# EasyEDA Pro project custom_ctrl_20250401.epro, schematic Schematic1
Board Name: typec; Create Date: 2025-01-17; Page Name: P1; Project Name: custom control; Schematic Name: Schematic1; Update Date: 2025-03-17; Company: 嘉立创EDA; Page Size: A4; Version: V1.0
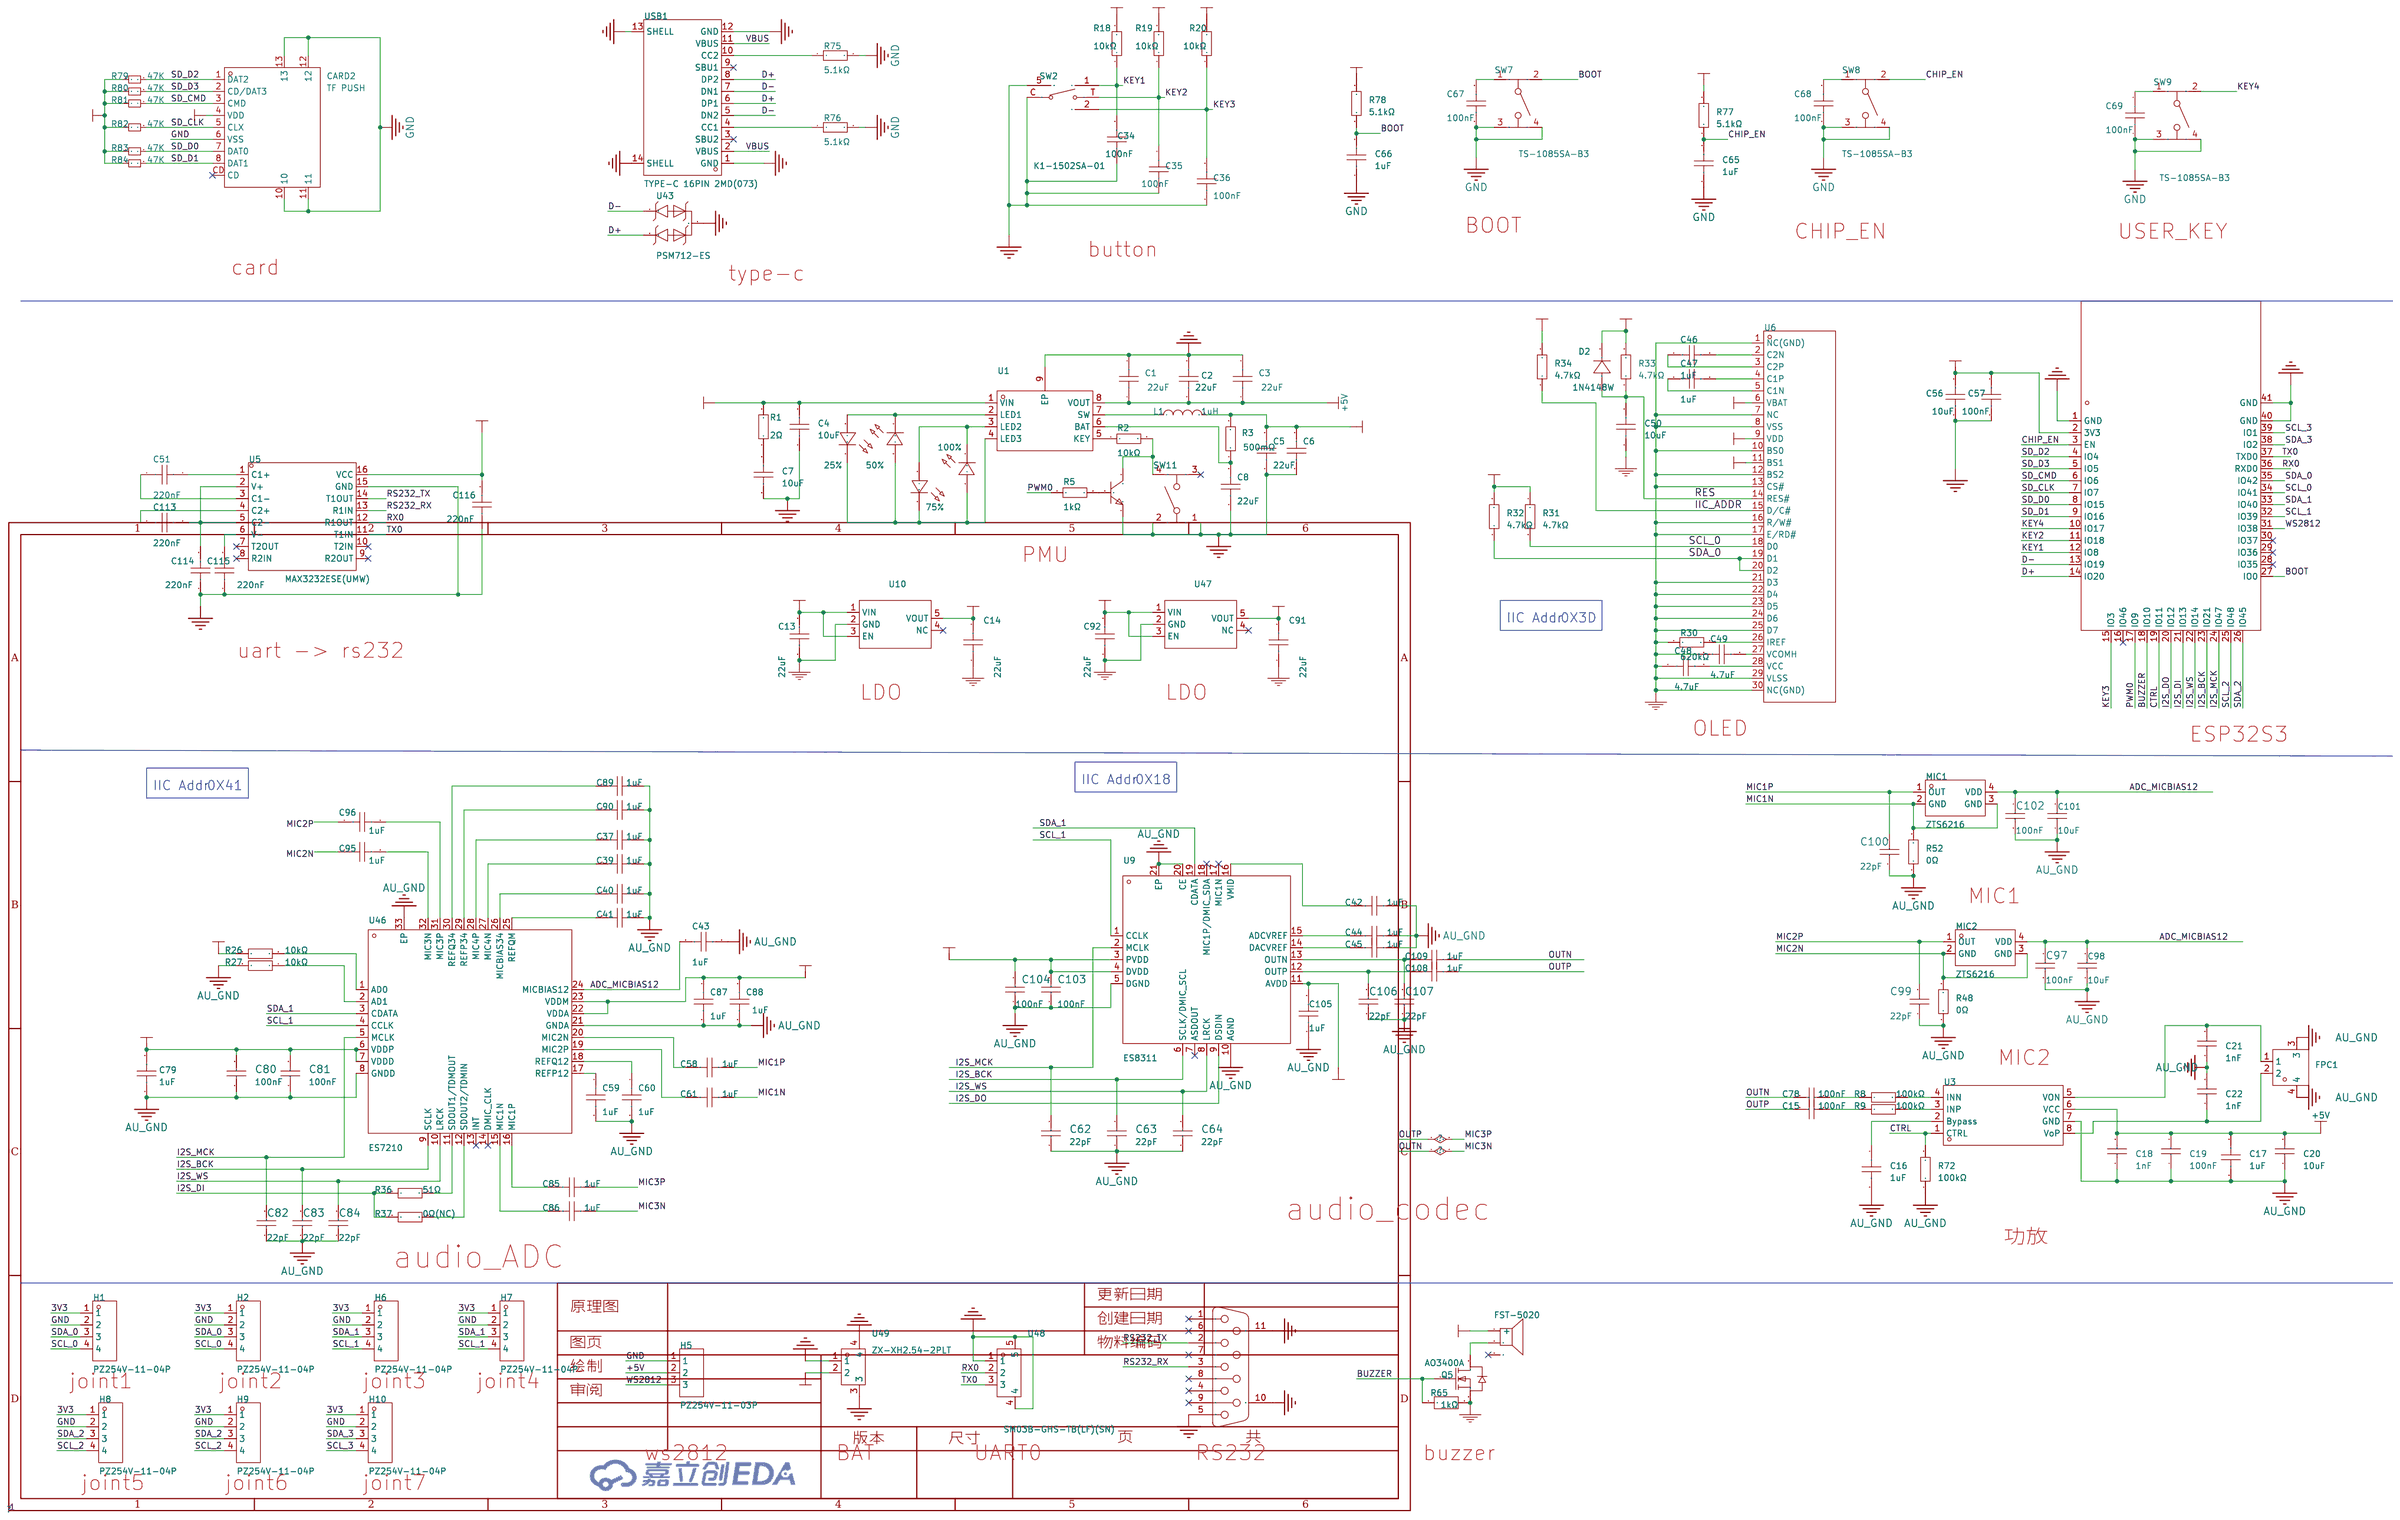
[diagram p0: schematic sheet]

## Parts
BUZZER1  FST-5020  [BUZ-SMD_FST-5020]
C1  22uF  [C0603]
C2  22uF  [C0603]
C3  22uF  [C0603]
C4  10uF  [C0402]
C5  22uF  [C0603]
C6  22uF  [C0603]
C7  10uF  [C0402]
C8  22uF  [C0603]
C13  22uF  [C0603]
C14  22uF  [C0603]
C15  100nF  [C0402]
C16  1uF  [C0402]
C17  1uF  [C0402]
C18  1nF  [C0402]
C19  100nF  [C0402]
C20  10uF  [C0402]
C21  1nF  [C0402]
C22  1nF  [C0402]
C34  100nF  [C0402]
C35  100nF  [C0402]
C36  100nF  [C0402]
C37  1uF  [C0402]
C39  1uF  [C0402]
C40  1uF  [C0402]
C41  1uF  [C0402]
C42  1uF  [C0402]
C43  1uF  [C0402]
C44  1uF  [C0402]
C45  1uF  [C0402]
C46  1uF  [C0402]
C47  1uF  [C0402]
C48  4.7uF  [C0402]
C49  4.7uF  [C0402]
C50  10uF  [C0402]
C51  220nF  [C0402]
C56  10uF  [C0402]
C57  100nF  [C0402]
C58  1uF  [C0402]
C59  1uF  [C0402]
C60  1uF  [C0402]
C61  1uF  [C0402]
C62  22pF  [C0402]
C63  22pF  [C0402]
C64  22pF  [C0402]
C65  1uF  [C0402]
C66  1uF  [C0402]
C67  100nF  [C0402]
C68  100nF  [C0402]
C69  100nF  [C0402]
C78  100nF  [C0402]
C79  1uF  [C0402]
C80  100nF  [C0402]
C81  100nF  [C0402]
C82  22pF  [C0402]
C83  22pF  [C0402]
C84  22pF  [C0402]
C85  1uF  [C0402]
C86  1uF  [C0402]
C87  1uF  [C0402]
C88  1uF  [C0402]
C89  1uF  [C0402]
C90  1uF  [C0402]
C91  22uF  [C0603]
C92  22uF  [C0603]
C95  1uF  [C0402]
C96  1uF  [C0402]
C97  100nF  [C0402]
C98  10uF  [C0402]
C99  22pF  [C0402]
C100  22pF  [C0402]
C101  10uF  [C0402]
C102  100nF  [C0402]
C103  100nF  [C0402]
C104  100nF  [C0402]
C105  1uF  [C0402]
C106  22pF  [C0402]
C107  22pF  [C0402]
C108  1uF  [C0402]
C109  1uF  [C0402]
C113  220nF  [C0402]
C114  220nF  [C0402]
C115  220nF  [C0402]
C116  220nF  [C0402]
CARD2  TF PUSH  [TF-SMD_TF-PUSH]
D2  1N4148W  [SOD-123_L2.7-W1.6-LS3.7-RD-1]
D25  25%  [LED_0603]
D50  50%  [LED_0603]
D75  75%  [LED_0603]
D100  100%  [LED_0603]
FPC1  HC-1.25-2PLT  [CONN-SMD_HC-1.25-2PLT]
H1  PZ254V-11-04P  [HDR-TH_4P-P2.54-V-M]
H2  PZ254V-11-04P  [HDR-TH_4P-P2.54-V-M]
H5  PZ254V-11-03P  [HDR-TH_3P-P2.54-V-M]
H6  PZ254V-11-04P  [HDR-TH_4P-P2.54-V-M]
H7  PZ254V-11-04P  [HDR-TH_4P-P2.54-V-M]
H8  PZ254V-11-04P  [HDR-TH_4P-P2.54-V-M]
H9  PZ254V-11-04P  [HDR-TH_4P-P2.54-V-M]
H10  PZ254V-11-04P  [HDR-TH_4P-P2.54-V-M]
L1  1uH  [IND-SMD_L4.4-W4.2]
MIC1  ZTS6216  [MIC-SMD_4P-L2.8-W1.9-P1.84-TL]
MIC2  ZTS6216  [MIC-SMD_4P-L2.8-W1.9-P1.84-TL]
Q1  S8050  [SOT-23-3_L2.9-W1.6-P1.90-LS2.8-BR]
Q5  AO3400A  [SOT-23-3_L2.9-W1.6-P1.90-LS2.8-BR]
R1  2Ω  [R0402]
R2  10kΩ  [R0402]
R3  500mΩ  [R0603]
R5  1kΩ  [R0402]
R8  100kΩ  [R0402]
R9  100kΩ  [R0402]
R18  10kΩ  [R0402]
R19  10kΩ  [R0402]
R20  10kΩ  [R0402]
R26  10kΩ  [R0402]
R27  10kΩ  [R0402]
R30  620kΩ  [R0402]
R31  4.7kΩ  [R0402]
R32  4.7kΩ  [R0402]
R33  4.7kΩ  [R0402]
R34  4.7kΩ  [R0402]
R36  51Ω  [R0402]
R37  0Ω(NC)  [R0402]
R48  0Ω  [R0402]
R52  0Ω  [R0402]
R65  1kΩ  [R0402]
R72  100kΩ  [R0402]
R75  5.1kΩ  [R0402]
R76  5.1kΩ  [R0402]
R77  5.1kΩ  [R0402]
R78  5.1kΩ  [R0402]
R79  47K  [R0402]
R80  47K  [R0402]
R81  47K  [R0402]
R82  47K  [R0402]
R83  47K  [R0402]
R84  47K  [R0402]
SW2  K1-1502SA-01  [KEY-SMD_K1-1502SA-01]
SW7  TS-1085SA-B3  [KEY-SMD_4P-L4.8-W4.6-P1.70-LS6.2-1]
SW8  TS-1085SA-B3  [KEY-SMD_4P-L4.8-W4.6-P1.70-LS6.2-1]
SW9  TS-1085SA-B3  [KEY-SMD_4P-L4.8-W4.6-P1.70-LS6.2-1]
SW11  TS-1085SA-B3  [KEY-SMD_4P-L4.8-W4.6-P1.70-LS6.2-1]
U1  IP5306  [ESOP-8_L4.9-W3.9-P1.27-LS6.0-BL-EP]
U2  ESP32-S3-WROOM-1-N16R8  [WIRELM-SMD_ESP32-S3-WROOM-1]
U3  NS4150B  [MSOP-8_L3.0-W3.0-P0.65-LS5.0-BL]
U5  MAX3232ESE(UMW)  [SOP-16_L9.9-W3.9-P1.27-LS6.0-BL]
U6  OLED128O064AGAP3N00000  [tft-smd_oled128o064agap3n00000]
U9  ES8311  [WQFN-20_L3.0-W3.0-P0.40-BL-EP1.7]
U10  RT9013-3.3GB  [SOT-23-5_L2.9-W1.6-P0.94-LS2.8-BL]
U43  PSM712-ES  [SOT-23-3_L2.9-W1.3-P1.90-LS2.4-BR]
U44  D-SUB-DR-9PCM-CB  [DB9-TH_D-SUB-DR-9PCM-CB]
U46  ES7210  [QFN-32_L4.0-W4.0-P0.40-BL-EP2.7]
U47  RT9013-3.3GB  [SOT-23-5_L2.9-W1.6-P0.94-LS2.8-BL]
U48  SM03B-GHS-TB(LF)(SN)  [CONN-TH_SM03B-GHS-TB-LF-SN]
U49  ZX-XH2.54-2PLT  [CONN-SMD_2P-P2.50_HCTL_HC-XH-2ALT]
USB1  TYPE-C 16PIN 2MD(073)  [USB-C-SMD_TYPE-C-6PIN-2MD-073]

## Library data of the parts
BUZZER1 = FST-5020: Supplier: LCSC; Supplier Part: C391029; Manufacturer: FUET; JLCPCB Part Class: Extended Part; Frequency: 4000Hz; Check: false
C1-C3 C5 C6 C8 C13 C14 C91 C92 = CGA0603X5R226M160JT: 容值:22uF;精度:±20%;额定电压:16V;材质(温度系数):X5R;; LCSC Part Name: 22uF ±20% 16V; Supplier Part: C6119868; Manufacturer: HRE(芯声); Supplier Footprint: 0603; JLCPCB Part Class: Extended Part; Supplier: LCSC; Tolerance: ±20%; Voltage Rated: 16V; Temperature Coefficient: X5R
C4 C7 C50 C56 = CL05A106MQ5NUNC: 容值:10uF;精度:±20%;额定电压:6.3V;材质(温度系数):X5R;; LCSC Part Name: 10uF ±20% 6.3V; Supplier Part: C15525; Manufacturer: SAMSUNG(三星); Supplier Footprint: 0402; JLCPCB Part Class: Basic Part; Datasheet: https://atta.szlcsc.com/upload/public/pdf/source/20220823/2B02EE04F8F211D38A52DCB16EB6BEBA.pdf; Supplier: LCSC; Tolerance: ±20%; Voltage Rated: 6.3V; Temperature Coefficient: X5R
C15 C19 C78 = 0402B104K160NT: 容值:100nF;精度:±10%;额定电压:16V;材质(温度系数):X7R;; LCSC Part Name: 100nF ±10% 16V; Supplier Part: C41851; Manufacturer: FH(风华); Supplier Footprint: 0402; JLCPCB Part Class: 扩展库; Datasheet: https://atta.szlcsc.com/upload/public/pdf/source/20200305/C486355_26A10D38EF8C2A5C37091D0039909270.pdf; Supplier: LCSC; Tolerance: ±10%; Voltage Rated: 16V; Temperature Coefficient: X7R
C16 C17 = CL05A105KA5NQNC: 容值:1uF;精度:±10%;额定电压:25V;材质(温度系数):X5R;; LCSC Part Name: 1uF ±10% 25V; Supplier Part: C52923; Manufacturer: SAMSUNG(三星); Supplier Footprint: 0402; JLCPCB Part Class: 基础库; Datasheet: https://atta.szlcsc.com/upload/public/pdf/source/20160103/1457707735223.pdf; Supplier: LCSC; Tolerance: ±10%; Voltage Rated: 25V; Temperature Coefficient: X5R
C18 C21 C22 = 0402B102K500NT: 容值:1nF;精度:±10%;额定电压:50V;材质(温度系数):X7R;; LCSC Part Name: 1nF ±10% 50V; Supplier Part: C1523; Manufacturer: FH(风华); Supplier Footprint: 0402; JLCPCB Part Class: 基础库; Datasheet: https://atta.szlcsc.com/upload/public/pdf/source/20200305/C486355_26A10D38EF8C2A5C37091D0039909270.pdf; Supplier: LCSC; Tolerance: ±10%; Voltage Rated: 50V; Temperature Coefficient: X7R
C20 = CL05A106MQ5NUNC: 容值:10uF;精度:±20%;额定电压:6.3V;材质(温度系数):X5R;; LCSC Part Name: 10uF ±20% 6.3V; Supplier Part: C15525; Manufacturer: SAMSUNG(三星); Supplier Footprint: 0402; JLCPCB Part Class: 基础库; Datasheet: https://atta.szlcsc.com/upload/public/pdf/source/20220823/2B02EE04F8F211D38A52DCB16EB6BEBA.pdf; Supplier: LCSC; Tolerance: ±20%; Voltage Rated: 6.3V; Temperature Coefficient: X5R
C34-C36 C57 = CL05B104KO5NNNC: 容值:100nF;精度:±10%;额定电压:16V;材质(温度系数):X7R;; LCSC Part Name: 100nF ±10% 16V; Supplier Part: C1525; Manufacturer: SAMSUNG(三星); Supplier Footprint: 0402; JLCPCB Part Class: Basic Part; Datasheet: https://atta.szlcsc.com/upload/public/pdf/source/20160218/1457707763339.pdf; Supplier: LCSC; Tolerance: ±10%; Voltage Rated: 16V; Temperature Coefficient: X7R
C37 C39-C45 C58-C61 C79 C85-C90 C95 C96 C105 C108 C109 = CL05A105KA5NQNC: 容值:1uF;精度:±10%;额定电压:25V;材质(温度系数):X5R;; LCSC Part Name: 1uF ±10% 25V; Supplier Part: C52923; Manufacturer: SAMSUNG(三星); Supplier Footprint: 0402; Datasheet: https://atta.szlcsc.com/upload/public/pdf/source/20160103/1457707735223.pdf; Supplier: LCSC; Tolerance: ±10%; Voltage Rated: 25V; Temperature Coefficient: X5R; Check: true
C46 C47 C65 C66 = CL05A105KA5NQNC: 容值:1uF;精度:±10%;额定电压:25V;材质(温度系数):X5R;; LCSC Part Name: 1uF ±10% 25V; Supplier Part: C52923; Manufacturer: SAMSUNG(三星); Supplier Footprint: 0402; JLCPCB Part Class: Basic Part; Datasheet: https://atta.szlcsc.com/upload/public/pdf/source/20160103/1457707735223.pdf; Supplier: LCSC; Tolerance: ±10%; Voltage Rated: 25V; Temperature Coefficient: X5R
C48 C49 = CL05A475KP5NRNC: 容值:4.7uF;精度:±10%;额定电压:10V;材质(温度系数):X5R;; LCSC Part Name: 4.7uF ±10% 10V; Supplier Part: C368809; Manufacturer: SAMSUNG(三星); Supplier Footprint: 0402; JLCPCB Part Class: Extended Part; Datasheet: https://atta.szlcsc.com/upload/public/pdf/source/20160218/1457707763339.pdf; Supplier: LCSC; Tolerance: ±10%; Voltage Rated: 10V; Temperature Coefficient: X5R
C51 C113-C116 = CL05B224KO5NNNC: 容值:220nF;精度:±10%;额定电压:16V;材质(温度系数):X7R;; LCSC Part Name: 220nF ±10% 16V; Supplier Part: C16772; Manufacturer: SAMSUNG(三星); Supplier Footprint: 0402; JLCPCB Part Class: Basic Part; Datasheet: https://atta.szlcsc.com/upload/public/pdf/source/20160218/1457707763339.pdf; Supplier: LCSC; Tolerance: ±10%; Voltage Rated: 16V; Temperature Coefficient: X7R
C62-C64 C82-C84 C99 C100 C106 C107 = 0402CG220J500NT: 容值:22pF;精度:±5%;额定电压:50V;材质(温度系数):C0G;; LCSC Part Name: 22pF ±5% 50V; Supplier Part: C1555; Manufacturer: FH(风华); Supplier Footprint: 0402; Datasheet: https://atta.szlcsc.com/upload/public/pdf/source/20200305/C486355_26A10D38EF8C2A5C37091D0039909270.pdf; Supplier: LCSC; Tolerance: ±5%; Voltage Rated: 50V; Temperature Coefficient: C0G; Check: true
C67-C69 = CC0402KRX7R7BB104: 容值:100nF;精度:±10%;额定电压:16V;材质(温度系数):X7R;; LCSC Part Name: 100nF ±10% 16V; Supplier Part: C60474; Manufacturer: YAGEO(国巨); Supplier Footprint: 0402; JLCPCB Part Class: Extended Part; Datasheet: https://atta.szlcsc.com/upload/public/pdf/source/20211223/9278FD768280B81DDBEF48FA36411A03.pdf; Supplier: LCSC; Tolerance: ±10%; Voltage Rated: 16V; Temperature Coefficient: X7R
C80 C81 C97 C102-C104 = 0402B104K500NT: 温度系数:X7R;容值:100nF;精度:±10%;额定电压:50V;; LCSC Part Name: 100nF(104) ±10% 50V; Supplier Part: C110251; Manufacturer: FH(风华); Supplier Footprint: 0402; Supplier: LCSC; Temperature Coefficient: X7R; Tolerance: ±10%; Voltage Rated: 50V; Check: true
C98 C101 = CL05A106MQ5NUNC: 容值:10uF;精度:±20%;额定电压:6.3V;材质(温度系数):X5R;; LCSC Part Name: 10uF ±20% 6.3V; Supplier Part: C15525; Manufacturer: SAMSUNG(三星); Supplier Footprint: 0402; Datasheet: https://atta.szlcsc.com/upload/public/pdf/source/20220823/2B02EE04F8F211D38A52DCB16EB6BEBA.pdf; Supplier: LCSC; Tolerance: ±20%; Voltage Rated: 6.3V; Temperature Coefficient: X5R; Check: true
CARD2 = TF PUSH: 卡连接方式:自弹式;卡类型:MicroSD卡(TF卡);连接器类型:卡座;本体最大高度:2mm;工作温度范围:-20℃~+90℃;; LCSC Part Name: 自弹式 MicroSD卡(TF卡) 卡座; Supplier Part: C393941; Manufacturer: SHOU HAN(首韩); Supplier Footprint: SMD; JLCPCB Part Class: 扩展库; Datasheet: https://atta.szlcsc.com/upload/public/pdf/source/20191011/C393941_0DDD896EE907FEB750D8B7B8982E2A67.pdf; Supplier: LCSC; Card Connection Mode: 自弹式; Card Type: MicroSD卡(TF卡); Connector Type: 卡座; Additional Card Detection Pins: 无; Maximum Body Height: 2mm; Operating Temperature Range: -20℃~+90℃
D2 = 1N4148W: 二极管配置:-;正向压降(Vf):1.25V@100mA;直流反向耐压(Vr):-;平均整流电流(Io):150mA;功率:500mW;反向恢复时间(trr):4ns;; LCSC Part Name: 电流:150mA; Supplier Part: C2892570; Manufacturer: YONGYUTAI(永裕泰); Supplier Footprint: SOD-123; JLCPCB Part Class: 扩展库; Datasheet: https://atta.szlcsc.com/upload/public/pdf/source/20210906/424708ED2E76C29D36F058AA2585E916.pdf; Supplier: LCSC; Forward Voltage (Vf@If): 1.25V@100mA; Average Rectified Current (Io): 150mA; Power Dissipation: 500mW; Reverse Leakage Current: 5uA@75V; Reverse Recovery Time (trr): 4ns
D25 D50 D75 D100 = LED_0603-R: Supplier Footprint: 0603
FPC1 = HC-1.25-2PLT: 插针结构:1x2P;间距:1.25mm;安装方式:立贴;参考系列:PicoBlade(MX 1.25);总PIN数:2P;排数:1;每排PIN数:2;行距:-;额定电流:2A;触头材质:黄铜;触头镀层:锡;工作温度范围:-25℃~+85℃;; LCSC Part Name: 1x2P 间距:1.25mm 立贴 系列:PicoBlade(MX 1.25); Supplier Part: C2845388; Manufacturer: HCTL(华灿天禄); Supplier Footprint: SMD,P=1.25mm; JLCPCB Part Class: Extended Part; Datasheet: https://atta.szlcsc.com/upload/public/pdf/source/20230707/8E5913B5A3195C18F5EE12EA4CB86B82.pdf; Supplier: LCSC; Pins Structure: 1x2P; Pitch: 1.25mm; Mounting Style: 立贴; Reference Series: PicoBlade(MX 1.25); Number of Pins: 2P; Number of Rows: 1; Number of PINs Per Row: 2; Current Rating (Max): 2A; Contact Material: 黄铜; Contact Plating: 锡; Operating Temperature Range: -25℃~+85℃; Rated Voltage (Max): 250V; Plastic Material: LCP; Flame Retardant Rating: UL94V-0; Supplementary Features: 辅助焊脚; Z-Height of the Board: 4.75mm; X-Length of Bottom Edge on Board (Spacing Line): 7.3mm; Y-Width of Bottom Edge on Board: 4.2mm
H1 H2 H6-H10 = PZ254V-11-04P: 插针结构:1x4P;间距:2.54mm;行距:-;圆针/方针:方针;安装类型:直插;排数:单排;总PIN位数:4P;额定电流:3A;额定电压:250V;配合针长度:6mm;塑高:2.5mm;端接针长度:3mm;触头材质:-;工作温度范围:-40℃~+105℃;颜色:黑色;; LCSC Part Name: 间距:2.54mm 1x4P 直插 方针; Supplier Part: C2691448; Manufacturer: XFCN(兴飞); Supplier Footprint: 插件,P=2.54mm; JLCPCB Part Class: 扩展库; Datasheet: https://atta.szlcsc.com/upload/public/pdf/source/20200309/C492403_F9F19131791D08044AD4F84F8E751A34.pdf; Supplier: LCSC; Pin Structure: 1x4P; Pitch: 2.54mm; Circluar Pins/Square Pins: 方针; Mounting Type: 直插; Number of Rows: 单排; Number of Pins: 4P; Current Rating (Max): 3A; Voltage Rating (Max): 250V; Length of Mating Pin: 6mm; Insulation Height: 2.5mm; Length of End Connection Pin: 3mm; Operating Temperature Range: -40℃~+105℃; Color: 黑色
H5 = PZ254V-11-03P: 插针结构:1x3P;间距:2.54mm;行距:-;圆针/方针:方针;安装方式:直插;排数:单排;总PIN位数:3P;额定电流:3A;额定电压:250V;配合针长度:6mm;塑高:2.5mm;端接针长度:3mm;工作温度:-40℃~+105℃;颜色:黑色;; LCSC Part Name: 1x3P 间距:2.54mm 方针 直插; Supplier Part: C2937625; Manufacturer: XFCN(兴飞); Supplier Footprint: 插件,P=2.54mm; JLCPCB Part Class: 扩展库; Datasheet: https://atta.szlcsc.com/upload/public/pdf/source/20200309/C492402_8335C3D49C4E4C618838D59BB1D024C1.pdf; Supplier: LCSC; Pin Structure: 1x3P; Pitch: 2.54mm; Circluar Pins/Square Pins: 方针; Mounting Type: 直插; Number of Rows: 单排; Number of Pins: 3P; Current Rating: 3A; Voltage Rating (Max): 250V; Length of Mating Pin: 6mm; Insulation Height: 2.5mm; Length of End Connection Pin: 3mm; Operating Temperature: -40℃~+105℃; Color: 黑色
L1 = APS04H20M1R0: 电感值:1uH;精度:±20%;额定电流:5.25A;; LCSC Part Name: 1uH ±20% 5.25A 21.5mΩ; Supplier Part: C706859; Manufacturer: Coilank(驰兴电感); Supplier Footprint: 0420; JLCPCB Part Class: Extended Part; Supplier: LCSC; Tolerance: ±20%; Rated Current: 5.25A; DC Resistance (DCR): 21.5mΩ
MIC1 MIC2 = ZTS6216: 方向:全指向;灵敏度:-38dB;信噪比:65dB;电流消耗:120uA;电源电压:1.5V~3.6V;阻抗:100Ω;; Supplier Part: C481302; Manufacturer: ZILLTEK(钰太); Supplier Footprint: SMD,2.75x1.85x1mm; Datasheet: https://atta.szlcsc.com/upload/public/pdf/source/20200316/C481302_3CBECE2A7DED4DFD53CEA082844189F4.pdf; Supplier: LCSC; Direction: 全指向; Sensitivity: -38dB; SNR(Signal to Noise Ratio): 65dB; Current Consumption: 120uA; Supply Voltage: 1.5V~3.6V; Impedance: 100Ω; Check: true
Q1 = S8050_C105433: 晶体管类型:NPN;集射极击穿电压(Vceo):25V;集电极电流(Ic):500mA;功率(Pd):300mW;直流电流增益(hFE@Ic,Vce):120@50mA,1V;; LCSC Part Name: NPN 25V 500mA L档 120-200; Supplier Part: C105433; Manufacturer: CJ(江苏长电/长晶); Supplier Footprint: SOT-23; JLCPCB Part Class: Extended Part; Datasheet: https://atta.szlcsc.com/upload/public/pdf/source/20170415/1492237762328.pdf; Supplier: LCSC; Transistor Type: NPN; Collector-Emitter Breakdown Voltage (Vceo): 25V; Collector Current (Ic): 500mA; Power Dissipation (Pd): 300mW; Collector Cut-Off Current (Icbo): 100nA; Collector-Emitter Saturation Voltage (VCE(sat)@Ic,Ib): 600mV@500mA,50mA; DC Current Gain (hFE@Ic,Vce): 120@50mA,1V; Transition Frequency (fT): 150MHz; Operating Temperature: +150℃@(Tj); Check: false
Q5 = AO3400A: Supplier: LCSC; Manufacturer: AOS; Supplier Part: C20917; JLCPCB Part Class: Basic Part; Check: false
R1 = 0402WGF200KTCE: 电阻类型:厚膜电阻;阻值:2Ω;精度:±1%;功率:62.5mW;最大工作电压:50V;温度系数:±200ppm/℃;; LCSC Part Name: 2Ω ±1% 62.5mW 厚膜电阻; Supplier Part: C270630; Manufacturer: UNI-ROYAL(厚声); Supplier Footprint: 0402; JLCPCB Part Class: Extended Part; Datasheet: https://atta.szlcsc.com/upload/public/pdf/source/20200306/C422600_1E6D84923E4A46A82E41ADD87F860B5C.pdf; Supplier: LCSC; Type: 厚膜电阻; Tolerance: ±1%; Power(Watts): 62.5mW; Overload Voltage (Max): 50V; Temperature Coefficient: ±200ppm/℃; Operating Temperature Range: -55℃~+155℃
R2 R18-R20 = 0402WGF1002TCE: 电阻类型:厚膜电阻;阻值:10kΩ;精度:±1%;功率:62.5mW;最大工作电压:50V;温度系数:±100ppm/℃;; LCSC Part Name: 厚膜电阻 10kΩ ±1% 62.5mW; Supplier Part: C25744; Manufacturer: UNI-ROYAL(厚声); Supplier Footprint: 0402; JLCPCB Part Class: Basic Part; Datasheet: https://atta.szlcsc.com/upload/public/pdf/source/20200306/C422600_1E6D84923E4A46A82E41ADD87F860B5C.pdf; Supplier: LCSC; Type: 厚膜电阻; Tolerance: ±1%; Power(Watts): 62.5mW; Temperature Coefficient: ±100ppm/℃; Overload Voltage (Max): 50V; Operating Temperature Range: -55℃~+155℃
R3 = FRL0603JR500TS: 电阻类型:厚膜电阻;阻值:500mΩ;精度:±5%;功率:100mW;最大工作电压:100V;温度系数:±300ppm/℃;; LCSC Part Name: 500mΩ ±5% 100mW 厚膜电阻; Supplier Part: C2930046; Manufacturer: FOJAN(富捷); Supplier Footprint: 0603; JLCPCB Part Class: Extended Part; Datasheet: https://atta.szlcsc.com/upload/public/pdf/source/20211221/925EC7D7225764EE0046F22065062C87.pdf; Supplier: LCSC; Type: 厚膜电阻; Tolerance: ±5%; Power(Watts): 100mW; Overload Voltage (Max): 100V; Temperature Coefficient: ±300ppm/℃; Operating Temperature Range: -55℃~+155℃
R5 R65 = 0402WGF1001TCE: 电阻类型:厚膜电阻;阻值:1kΩ;精度:±1%;功率:62.5mW;最大工作电压:50V;温度系数:±100ppm/℃;; LCSC Part Name: 1kΩ ±1% 62.5mW 厚膜电阻; Supplier Part: C11702; Manufacturer: UNI-ROYAL(厚声); Supplier Footprint: 0402; JLCPCB Part Class: Basic Part; Datasheet: https://atta.szlcsc.com/upload/public/pdf/source/20200306/C422600_1E6D84923E4A46A82E41ADD87F860B5C.pdf; Supplier: LCSC; Type: 厚膜电阻; Tolerance: ±1%; Power(Watts): 62.5mW; Overload Voltage (Max): 50V; Temperature Coefficient: ±100ppm/℃; Operating Temperature Range: -55℃~+155℃
R8 R9 R72 = RC0402FR-07100KL: 电阻类型:厚膜电阻;阻值:100kΩ;精度:±1%;功率:62.5mW;最大工作电压:50V;温度系数:±100ppm/℃;; LCSC Part Name: 厚膜电阻 100kΩ ±1% 62.5mW; Supplier Part: C60491; Manufacturer: YAGEO(国巨); Supplier Footprint: 0402; JLCPCB Part Class: 扩展库; Datasheet: https://atta.szlcsc.com/upload/public/pdf/source/20180927/C295883_E8D83085EA81BD7DE0B2B681138C15EE.pdf; Supplier: LCSC; Type: 厚膜电阻; Tolerance: ±1%; Power(Watts): 62.5mW; Overload Voltage (Max): 50V; Temperature Coefficient: ±100ppm/℃; Operating Temperature Range: -55℃~+155℃
R26 R27 = 0402WGF1002TCE: 电阻类型:厚膜电阻;阻值:10kΩ;精度:±1%;功率:62.5mW;温度系数:±100ppm/℃;; LCSC Part Name: 厚膜电阻 10kΩ ±1% 62.5mW; Supplier Part: C25744; Manufacturer: UNI-ROYAL(厚声); Supplier Footprint: 0402; Datasheet: https://atta.szlcsc.com/upload/public/pdf/source/20200306/C422600_1E6D84923E4A46A82E41ADD87F860B5C.pdf; Supplier: LCSC; Type: 厚膜电阻; Tolerance: ±1%; Power(Watts): 62.5mW; Temperature Coefficient: ±100ppm/℃; Overload Voltage (Max): 50V; Operating Temperature Range: -55℃~+155℃; Check: true
R30 = FRC0402F6203TS: 电阻类型:厚膜电阻;阻值:620kΩ;精度:±1%;功率:62.5mW;最大工作电压:50V;温度系数:±100ppm/℃;; LCSC Part Name: 620kΩ ±1% 62.5mW 厚膜电阻; Supplier Part: C2909373; Manufacturer: FOJAN(富捷); Supplier Footprint: 0402; JLCPCB Part Class: Extended Part; Datasheet: https://atta.szlcsc.com/upload/public/pdf/source/20211221/925EC7D7225764EE0046F22065062C87.pdf; Supplier: LCSC; Type: 厚膜电阻; Tolerance: ±1%; Power(Watts): 62.5mW; Overload Voltage (Max): 50V; Temperature Coefficient: ±100ppm/℃; Operating Temperature Range: -55℃~+155℃
R31-R34 = 0402WGF4701TCE: 电阻类型:厚膜电阻;阻值:4.7kΩ;精度:±1%;功率:62.5mW;最大工作电压:50V;温度系数:±100ppm/℃;; LCSC Part Name: 4.7kΩ ±1% 62.5mW 厚膜电阻; Supplier Part: C25900; Manufacturer: UNI-ROYAL(厚声); Supplier Footprint: 0402; JLCPCB Part Class: Basic Part; Datasheet: https://atta.szlcsc.com/upload/public/pdf/source/20200306/C422600_1E6D84923E4A46A82E41ADD87F860B5C.pdf; Supplier: LCSC; Type: 厚膜电阻; Tolerance: ±1%; Power(Watts): 62.5mW; Overload Voltage (Max): 50V; Temperature Coefficient: ±100ppm/℃; Operating Temperature Range: -55℃~+155℃
R36 = 0402WGF510JTCE: 电阻类型:厚膜电阻;阻值:51Ω;精度:±1%;功率:62.5mW;最大工作电压:50V;温度系数:±100ppm/℃;; LCSC Part Name: 51Ω ±1% 62.5mW 厚膜电阻; Supplier Part: C25125; Manufacturer: UNI-ROYAL(厚声); Supplier Footprint: 0402; Datasheet: https://atta.szlcsc.com/upload/public/pdf/source/20200306/C422600_1E6D84923E4A46A82E41ADD87F860B5C.pdf; Supplier: LCSC; Type: 厚膜电阻; Tolerance: ±1%; Power(Watts): 62.5mW; Overload Voltage (Max): 50V; Temperature Coefficient: ±100ppm/℃; Operating Temperature Range: -55℃~+155℃; Check: true
R37 R48 R52 = 0402WGF0000TCE: 电阻类型:厚膜电阻;阻值:0Ω;精度:±1%;功率:62.5mW;; LCSC Part Name: 0Ω ±1% 62.5mW; Supplier Part: C17168; Manufacturer: UNI-ROYAL(厚声); Supplier Footprint: 0402; Datasheet: https://atta.szlcsc.com/upload/public/pdf/source/20200306/C422600_1E6D84923E4A46A82E41ADD87F860B5C.pdf; Supplier: LCSC; Type: 厚膜电阻; Tolerance: ±1%; Power(Watts): 62.5mW; Temperature Coefficient: ±800ppm/℃; Overload Voltage (Max): 50V; Operating Temperature Range: -55℃~+155℃; Check: true
R75-R78 = 0402WGF5101TCE: 电阻类型:厚膜电阻;阻值:5.1kΩ;精度:±1%;功率:62.5mW;最大工作电压:50V;温度系数:±100ppm/℃;; LCSC Part Name: 5.1kΩ ±1% 62.5mW 厚膜电阻; Supplier Part: C25905; Manufacturer: UNI-ROYAL(厚声); Supplier Footprint: 0402; JLCPCB Part Class: Basic Part; Datasheet: https://atta.szlcsc.com/upload/public/pdf/source/20200306/C422600_1E6D84923E4A46A82E41ADD87F860B5C.pdf; Supplier: LCSC; Type: 厚膜电阻; Tolerance: ±1%; Power(Watts): 62.5mW; Overload Voltage (Max): 50V; Temperature Coefficient: ±100ppm/℃; Operating Temperature Range: -55℃~+155℃
R79-R84 = R0402: 精度: ±5%-1/16W
SW2 = K1-1502SA-01: Supplier Part: C145915; Manufacturer: 韩国韩荣; Supplier Footprint: SMD,12.4x11.8mm; Datasheet: https://atta.szlcsc.com/upload/public/pdf/source/20210810/68556D289DEA90EEE2C9C67C3CF0D02D.pdf; Supplier: LCSC
SW7-SW9 SW11 = TS-1085SA-B3: 电路结构:单刀单掷;按钮形状:矩形按钮;作用力:2.5N;安装方式:-;带灯:-;机械寿命:-;; LCSC Part Name: 轻触开关4.8*3.6*4.6无柱四脚中乌龟贴片250gf; Supplier Part: C498299; Manufacturer: Yuandi(元迪); JLCPCB Part Class: 扩展库; Datasheet: https://atta.szlcsc.com/upload/public/pdf/source/20200318/C498299_7147AE2D63A34A82BB6685115AE5D54F.pdf; Supplier: LCSC; Circuit: 单刀单掷; Actuator Style: 矩形按钮; Operating Force: 2.5N
U1 = IP5306: 2.1A充电2.4A放电高集成度移动电源SOC; Supplier Part: C181692; Manufacturer: INJOINIC(英集芯); Supplier Footprint: ESOP-8; JLCPCB Part Class: Extended Part; Datasheet: https://atta.szlcsc.com/upload/public/pdf/source/20180920/C181692_842C9BF636DF123BB66E91FC1AD6F13F.pdf; Supplier: LCSC
U2 = ESP32-S3-WROOM-1-N16R8: LCSC Part Name: 通用型Wi-Fi+低功耗蓝牙MCU模组; Supplier Part: C2913202; Manufacturer: ESPRESSIF(乐鑫); Supplier Footprint: SMD,18x25.5mm; JLCPCB Part Class: 扩展库; Datasheet: https://atta.szlcsc.com/upload/public/pdf/source/20220705/4E799F39581577F766659887F738A439.pdf; Supplier: LCSC
U3 = NS4150B_C189961: 功放类型:D类功放;输出功率:3Wx1@4Ω;; Supplier Part: C189961; Manufacturer: Nsiway(纳芯威); Supplier Footprint: MSOP-8; JLCPCB Part Class: 扩展库; Datasheet: https://atta.szlcsc.com/upload/public/pdf/source/20220916/DAE631F3909B9CBB38BDE76E3E6D5896.pdf; Supplier: LCSC; Type of Power Amplifier: D类功放; Output Power: 3Wx1@4Ω; Supply Voltage: 3V~5.25V
U5 = MAX3232ESE: 类型:收发器;数据速率:250Kbps;; LCSC Part Name: 3.0V至5.5V低功率多通道RS-232线收发器 使用0.1μF外部电容; Supplier Part: C2904738; Manufacturer: UMW(友台半导体); Supplier Footprint: SOP-16; JLCPCB Part Class: Extended Part; Datasheet: https://atta.szlcsc.com/upload/public/pdf/source/20240223/796E207CE11CAD2A32B129631DA1E0E4.pdf; Supplier: LCSC; Types: 收发器; Driver/receiver: 2/2; Data Rate: 250Kbps; Supply Voltage: 3V~3.6V；4.5V~5.5V; Operating Temperature: 0℃~+70℃; Number of Driver: 2; Number of receiver: 2
U6 = OLED128O064AGAP3N00000: 接口类型:-;尺寸(inch):-;像素分辨率:-;; Supplier Part: C17246337; Manufacturer: VISHAY(威世); Supplier: LCSC; Check: false
U9 = ES8311: Supplier Part: C962342; Manufacturer: Everest-semi(顺芯); Supplier Footprint: WQFN-20-EP(3x3); JLCPCB Part Class: 扩展库; Datasheet: https://atta.szlcsc.com/upload/public/pdf/source/20210630/C962342_E665EAE7274179BC7C5A390EC8AC685C.pdf; Supplier: LCSC; Check: true
U10 U47 = RT9013-3.3GB: Supplier Part: C9900009203; Supplier Footprint: SOT-23-5; JLCPCB Part Class: Extended Part; Supplier: LCSC
U43 = PSM712-ES: 极性:双向;反向截止电压(Vrwm):12V；7V;最大钳位电压:19V；26V;峰值脉冲电流(Ipp):17A;峰值脉冲功率(Ppp):350W;击穿电压:7.5V；13.3V;; LCSC Part Name: 712，两路双向ESD静电防护器件，30kV，CJ：40pF；RS485/RS422串口通讯防护; Supplier Part: C5180294; Manufacturer: ElecSuper(静芯微); Supplier Footprint: SOT-23; Datasheet: https://atta.szlcsc.com/upload/public/pdf/source/20240905/D084235AB9799A62A6C53EFD06F4CEE8.pdf; Supplier: LCSC; polarity: 双向; Reverse Stand-Off Voltage (Vrwm): 12V；7V; Maximum Clamping Voltage: 19V；26V; Peak Pulse Current (Ipp): 17A; Peak Pulse Power Dissipation (Ppp): 350W; Breakdown Voltage: 7.5V；13.3V; Reverse Leakage Current (Ir): 1uA; Number of Lines: 双路; Type: ESD
U44 = D-SUB-DR-9PCM-CB: 公母:母;总PIN位数:9P;安装方式:弯插;排数:2;额定电流-信号脚:3A;工作温度范围:-50℃~+105℃;; LCSC Part Name: D-Sub 母 P数:9P; Supplier Part: C19077337; Manufacturer: XUNPU(讯普); Supplier Footprint: 弯插; JLCPCB Part Class: 扩展库; Datasheet: https://atta.szlcsc.com/upload/public/pdf/source/20231108/FB2E8AB0BE4F620DDF3F7F4D0B9AFB97.pdf; Supplier: LCSC; Gender: 母; Number of Pins: 9P; Mounting Style: 弯插; Number of Rows: 2; Current Rating-Signal (Max): 3A; Operating Temperature Range: -50℃~+105℃
U46 = ES7210: 供电电压:-；-；-；-；-;; LCSC Part Name: 音频解码芯片; Supplier Part: C365743; Manufacturer: Everest-semi(顺芯); Supplier Footprint: QFN-32-EP(4x4); JLCPCB Part Class: 扩展库; Datasheet: https://atta.szlcsc.com/upload/public/pdf/source/20190124/C365743_EF64B9678A6C48719EEF660F22636096.pdf; Supplier: LCSC; Supply Voltage: -；-；-；-；-; Chip Type Parameters/Description: 音频解码芯片; Check: true
U48 = SM03B-GHS-TB(LF)(SN): 插针结构:1x3P;间距:1.25mm;安装方式:卧贴;参考系列:GH;总PIN数:3P;排数:1;每排PIN数:3;行距:-;额定电流:1A;触头材质:磷青铜;触头镀层:锡;工作温度范围:-25℃~+85℃;; LCSC Part Name: 1x3P 间距:1.25mm 卧贴 系列:GH; Supplier Part: C514175; Manufacturer: JST; Supplier Footprint: SMD,P=1.25mm,卧贴; JLCPCB Part Class: 扩展库; Datasheet: https://atta.szlcsc.com/upload/public/pdf/source/20200416/C514175_6D761544780BFF1FCAB26BE8A747A99F.pdf; Supplier: LCSC; Pins Structure: 1x3P; Pitch: 1.25mm; Mounting Style: 卧贴; Reference Series: GH; Number of Pins: 3P; Number of Rows: 1; Number of PINs Per Row: 3; Current Rating (Max): 1A; Contact Material: 磷青铜; Contact Plating: 锡; Operating Temperature Range: -25℃~+85℃; Rated Voltage (Max): 50V; Plastic Material: PA9T; Flame Retardant Rating: UL94V-0; Supplementary Features: 辅助焊脚; Colour: 白色; Z-Height of the Board: 4.25mm; X-Length of Bottom Edge on Board (Spacing Line): 7mm; Y-Width of Bottom Edge on Board: 4.13mm
U49 = ZX-XH2.54-2PLT: 插针结构:1x2P;间距:2.5mm;安装方式:立贴;参考系列:XH;总PIN数:2P;排数:1;每排PIN数:2;行距:-;额定电流:-;触头材质:黄铜;触头镀层:锡;工作温度:-;; LCSC Part Name: 1x2P 间距:2.5mm 立贴 系列:XH; Supplier Part: C7429680; Manufacturer: Megastar(兆星); Supplier Footprint: SMD,P=2.5mm,立贴; JLCPCB Part Class: 扩展库; Datasheet: https://atta.szlcsc.com/upload/public/pdf/source/20230619/87C018EBE425F10E4B035B436CF5FBBC.pdf; Supplier: LCSC; Pins Structure: 1x2P; Pitch: 2.5mm; Mounting Type: 立贴; Reference Series: XH; Number of Pins: 2P; Number of Rows: 1; Number of PINs Per Row: 2; Contact Material: 黄铜; Contact Plating: 锡; Supplementary Features: 辅助焊脚; Color: 米色; Z-Height of the Board: 8mm; X-Length of Bottom Edge on Board (Spacing Line): 10mm; Y-Width of Bottom Edge on Board: 8.3mm
USB1 = TYPE-C 16PIN 2MD(073): 连接器类型:Type-C;标准:USB 3.1;公母:母;安装方式:卧贴;触点数量:16P;端口数量:1;额定电流 - 电源:5A;工作温度范围:-25℃~+85℃;; LCSC Part Name: Type-C 母 卧贴; Supplier Part: C2765186; Manufacturer: SHOU HAN(首韩); Supplier Footprint: SMD; JLCPCB Part Class: 扩展库; Datasheet: https://atta.szlcsc.com/upload/public/pdf/source/20211123/39B17C16241EAC15C5E277BDA434118E.pdf; Supplier: LCSC; Connector Type: Type-C; Standard: USB 3.1; Gender: 母; Mounting Style: 卧贴; Number of Contacts: 16P; Number of Ports: 1; Current Rating - Power (Max): 5A; Operating Temperature Range: -25℃~+85℃; Rated Voltage (Max): 5V; Connect-Disconnect Life: 5千次; Core Colour: 黑色

## Nets
3V3: BUZZER1.1(+) C14.2 C56.2 C57.2 C116.2 CARD2.4(VDD) D2.1(K) H1.1 H2.1 H6.1 H7.1 H8.1 H9.1 H10.1 R18.2 R19.2 R20.2 R31.1 R32.2 R33.2 R34.2 R77.2 R78.2 R79.1 R80.1 R81.1 R82.1 R83.1 R84.1 U2.2(3V3) U5.16(VCC) U6.6(VBAT) U6.9(VDD) U6.11(BS1) U10.5(VOUT)
+5V: C1.1 C2.1 C3.1 C13.2 C17.1 C18.2 C19.2 C20.2 C92.2 H5.2 U1.8(VOUT) U3.6(VCC) U10.1(VIN) U10.3(EN) U47.1(VIN) U47.3(EN)
GND: C1.2 C2.2 C3.2 C4.1 C5.1 C6.1 C7.1 C8.1 C13.1 C14.1 C34.1 C35.1 C36.1 C48.1 C49.1 C50.1 C56.1 C57.1 C65.1 C66.1 C67.1 C68.1 C69.1 C91.1 C92.1 C114.1 C115.1 C116.1 CARD2.6(VSS) CARD2.10 CARD2.11 CARD2.12 CARD2.13 H1.2 H2.2 H5.1 H6.2 H7.2 H8.2 H9.2 H10.2 Q1.2 Q5.2(S) R30.1 R65.2 R75.2 R76.2 SW2.5 SW2.C SW7.3 SW7.4 SW8.3 SW8.4 SW9.3 SW9.4 SW11.1 SW11.2 U1.9(EP) U2.1(GND) U2.40(GND) U2.41(GND) U5.15(GND) U6.1(NC(GND)) U6.7(NC) U6.8(VSS) U6.10(BS0) U6.12(BS2) U6.13(CS#) U6.16(R/W#) U6.17(E/RD#) U6.21(D3) U6.22(D4) U6.23(D5) U6.24(D6) U6.25(D7) U6.29(VLSS) U6.30(NC(GND)) U10.2(GND) U43.3 U44.5 U44.10(MH1) U44.11(MH2) U47.2(GND) U48.1 U48.4 U48.5 U49.1 U49.3 U49.4 USB1.1(GND) USB1.12(GND) USB1.13(SHELL) USB1.14(SHELL)
VBAT: C5.2 C6.2 L1.2 R3.2 U49.2
VBUS: C4.2 R1.2 U1.1(VIN) USB1.2(VBUS) USB1.11(VBUS)
VDD_3V3: C79.2 C80.2 C81.2 C87.1 C88.1 C91.2 C103.2 C104.2 C105.2 R26.2 U9.3(PVDD) U9.4(DVDD) U9.11(AVDD) U46.6(VDDP) U46.7(VDDD) U46.22(VDDA) U46.23(VDDM) U47.5(VOUT)
ADC_MICBIAS12: C43.1 C97.1 C98.2 C101.2 C102.1 MIC1.4(VDD) MIC2.4(VDD) U46.24(MICBIAS12)
AU_GND: C16.2 C17.2 C18.1 C19.1 C20.1 C21.1 C22.2 C37.2 C39.2 C40.2 C41.2 C42.1 C43.2 C44.1 C45.1 C59.2 C60.2 C62.1 C63.1 C64.1 C79.1 C80.1 C81.1 C82.1 C83.1 C84.1 C87.2 C88.2 C89.2 C90.2 C97.2 C98.1 C99.1 C100.1 C101.1 C102.2 C103.1 C104.1 C105.1 C106.1 C107.1 FPC1.3 FPC1.4 R27.2 R48.1 R52.1 R72.1 U3.7(GND) U9.5(DGND) U9.10(AGND) U9.20(CE) U9.21(EP) U46.8(GNDD) U46.21(GNDA) U46.33(EP)
BOOT: C66.2 R78.1 SW7.2 U2.27(IO0)
BUZZER: Q5.1(G) R65.1 U2.18(IO10)
CHIP_EN: C65.2 R77.1 SW8.2 U2.3(EN)
CTRL: R72.2 U2.19(IO11) U3.1(CTRL)
D+: U2.14(IO20) U43.2 USB1.6(DP1) USB1.8(DP2)
D-: U2.13(IO19) U43.1 USB1.5(DN2) USB1.7(DN1)
I2S_BCK: C63.2 C83.2 U2.23(IO21) U9.6(SCLK/DMIC_SCL) U46.9(SCLK)
I2S_DI: R36.1 R37.1 U2.21(IO13)
I2S_DO: U2.20(IO12) U9.9(DSDIN)
I2S_MCK: C62.2 C82.2 U2.24(IO47) U9.2(MCLK) U46.5(MCLK)
I2S_WS: C64.2 C84.2 U2.22(IO14) U9.8(LRCK) U46.10(LRCK)
IIC_ADDR: R34.1 U6.15(D/C#)
KEY1: C34.2 R18.1 SW2.1 U2.12(IO8)
KEY2: C35.2 R19.1 SW2.T U2.11(IO18)
KEY3: C36.2 R20.1 SW2.2 U2.15(IO3)
KEY4: SW9.2 U2.10(IO17)
MIC1N: C61.1 MIC1.2(GND) MIC1.3(GND) R52.2
MIC1P: C58.1 C100.2 MIC1.1(OUT)
MIC2N: C95.1 MIC2.2(GND) MIC2.3(GND) R48.2
MIC2P: C96.1 C99.2 MIC2.1(OUT)
MIC3N: C78.2 C86.1 C109.1
MIC3P: C15.2 C85.1 C108.1
PWM0: R5.1 U2.17(IO9)
RES: C50.2 D2.2(A) R33.1 U6.14(RES#)
RS232_RX: U5.13(R1IN) U44.3
RS232_TX: U5.14(T1OUT) U44.2
RX0: U2.36(RXD0) U5.12(R1OUT) U48.2
SCL_0: H1.4 H2.4 R31.2 U2.34(IO41) U6.18(D0)
SCL_1: H6.4 H7.4 U2.32(IO39) U9.1(CCLK) U46.4(CCLK)
SCL_2: H8.4 H9.4 U2.25(IO48)
SCL_3: H10.4 U2.39(IO1)
SD_CLK: CARD2.5(CLX) R82.2 U2.7(IO7)
SD_CMD: CARD2.3(CMD) R81.2 U2.6(IO6)
SD_D0: CARD2.7(DAT0) R83.2 U2.8(IO15)
SD_D1: CARD2.8(DAT1) R84.2 U2.9(IO16)
SD_D2: CARD2.1(DAT2) R79.2 U2.4(IO4)
SD_D3: CARD2.2(CD/DAT3) R80.2 U2.5(IO5)
SDA_0: H1.3 H2.3 R32.1 U2.35(IO42) U6.19(D1) U6.20(D2)
SDA_1: H6.3 H7.3 U2.33(IO40) U9.19(CDATA) U46.3(CDATA)
SDA_2: H8.3 H9.3 U2.26(IO45)
SDA_3: H10.3 U2.38(IO2)
TX0: U2.37(TXD0) U5.11(T1IN) U48.3
WS2812: H5.3 U2.31(IO38)
$1N23620: R30.2 U6.26(IREF)
$1N23621: C49.2 U6.27(VCOMH)
$1N23622: C48.2 U6.28(VCC)
$1N23626: C46.2 U6.2(C2N)
$1N23627: C46.1 U6.3(C2P)
$1N23628: C47.1 U6.5(C1N)
$1N23629: C47.2 U6.4(C1P)
$1N23662: L1.1 U1.7(SW)
$1N23663: R2.1 U1.5(KEY)
$1N23665: C8.2 R3.1 U1.6(BAT)
$1N23671: D25.2(A) D50.1(C) U1.2(LED1)
$1N23672: D75.2(A) D100.1(C) U1.3(LED2)
$1N23673: D25.1(C) D50.2(A) D75.1(C) D100.2(A) U1.4(LED3)
$1N23676: C7.2 R1.1
$1N23677: Q1.1 R5.2
$1N23678: Q1.3 R2.2 SW11.4
$1N23741: R76.1 USB1.4(CC1)
$1N23744: R75.1 USB1.10(CC2)
$1N23765: BUZZER1.2 Q5.3(D)
$1N23776: C51.2 U5.1(C1+)
$1N23777: C51.1 U5.3(C1-)
$1N23778: C113.1 U5.4(C2+)
$1N23779: C113.2 C114.2 U5.2(V+) U5.5(C2-)
$1N23789: C115.2 U5.6(V-)
$1N27324: C67.2 SW7.1
$1N27440: C68.2 SW8.1
$1N27527: C69.2 SW9.1
$1N35832: C78.1 R8.1
$1N35833: R8.2 U3.4(INN)
$1N35834: C15.1 R9.1
$1N35835: R9.2 U3.3(INP)
$1N35838: C16.1 U3.2(Bypass)
$1N35849: C22.1 FPC1.2 U3.8(VoP)
$1N35850: C21.2 FPC1.1 U3.5(VON)
$1N39161: R26.1 U46.1(AD0)
$1N39162: R27.1 U46.2(AD1)
$1N39181: C85.2 U46.16(MIC1P)
$1N39182: C86.2 U46.15(MIC1N)
$1N39187: C59.1 U46.17(REFP12)
$1N39188: C60.1 U46.18(REFQ12)
$1N39190: C61.2 U46.19(MIC2P)
$1N39191: C58.2 U46.20(MIC2N)
$1N39202: C41.1 U46.25(REFQM)
$1N39203: C40.1 U46.26(MICBIAS34)
$1N39205: C39.1 U46.27(MIC4N)
$1N39206: C37.1 U46.28(MIC4P)
$1N39207: C90.1 U46.29(REFP34)
$1N39208: C89.1 U46.30(REFQ34)
$1N39216: R37.2 U46.12(SDOUT2/TDMIN)
$1N39217: R36.2 U46.11(SDOUT1/TDMOUT)
$1N41396: C95.2 U46.32(MIC3N)
$1N41441: C96.2 U46.31(MIC3P)
$1N51216: C106.2 C108.2 U9.12(OUTP)
$1N51217: C107.2 C109.2 U9.13(OUTN)
$1N51225: C44.2 U9.15(ADCVREF)
$1N51226: C45.2 U9.14(DACVREF)
$1N51228: C42.2 U9.16(VMID)

Not connected (* = marked no-connect by the designer): BUZZER1 3*; CARD2 CD*; SW11 3*; U2 16(IO46)* 28(IO35)* 29(IO36)* 30(IO37)*; U5 7(T2OUT)* 8(R2IN)* 9(R2OUT)* 10(T2IN)*; U9 7(ASDOUT)* 17(MIC1N)* 18(MIC1P/DMIC_SDA)*; U10 4(NC)*; U44 1* 4* 6* 7* 8* 9*; U46 13(INT)* 14(DMIC_CLK)*; U47 4(NC)*; USB1 3(SBU2)* 9(SBU1)*

## Notes on the sheet
- BOOT
- CHIP_EN
- USER_KEY
- button
- card
- type-c
- PMU
- IIC Addr
- 0X3D
- uart -> rs232
- LDO
- LDO
- OLED
- ESP32S3
- IIC Addr
- 0X41
- IIC Addr
- 0X18
- MIC1
- MIC2
- audio_codec
- 功放
- audio_ADC
- joint1
- joint2
- joint3
- joint4
- ws2812
- BAT
- UART0
- RS232
- buzzer
- joint5
- joint6
- joint7
